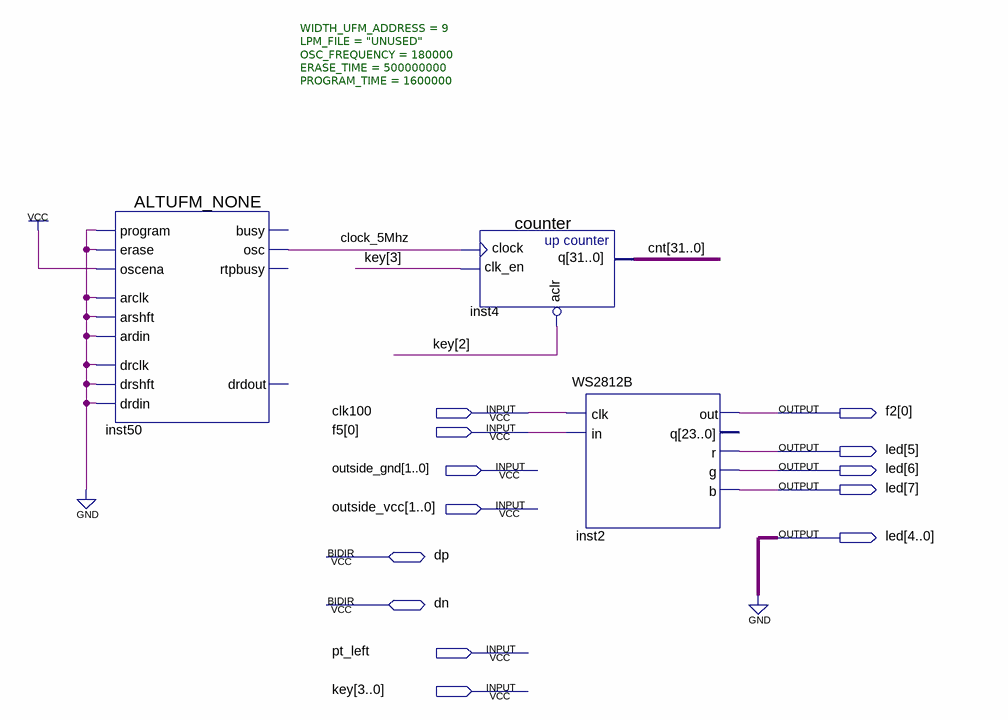
[diagram p0: schematic sheet]
// Quartus schematic max2.bdf as structural Verilog: 3 symbols, 13 pins
module max2 (
  input  clk100,
  input  [0:0] f5,
  input  [1:0] outside_gnd,
  input  [1:0] outside_vcc,
  input  pt_left,
  input  [3:0] key,
  inout  dp,
  inout  dn,
  output [0:0] f2,
  output [7:0] led
);

  wire clock_5Mhz;
  wire [31:0] cnt;

  ALTUFM_NONE #(.WIDTH_UFM_ADDRESS(9), .LPM_FILE("UNUSED"), .OSC_FREQUENCY(180000), .ERASE_TIME(500000000), .PROGRAM_TIME(1600000)) inst50 (
    .\program (1'b0), .erase(1'b0), .oscena(1'b1), .arclk(1'b0), .arshft(1'b0), .ardin(1'b0), .drclk(1'b0),
    .drshft(1'b0), .drdin(1'b0), .osc(clock_5Mhz));  // open: busy, rtpbusy, drdout
  counter inst4 (.clock(clock_5Mhz), .clk_en(key[3]), .aclr(~key[2]), .q(cnt));
  WS2812B inst2 (.clk(clk100), .in(f5[0]), .out(f2[0]), .r(led[5]), .g(led[6]), .b(led[7]));  // open: q

  assign led[4:0] = {5{1'b0}};
endmodule
